# EAGLE design main (EAGLE 6.6.0)
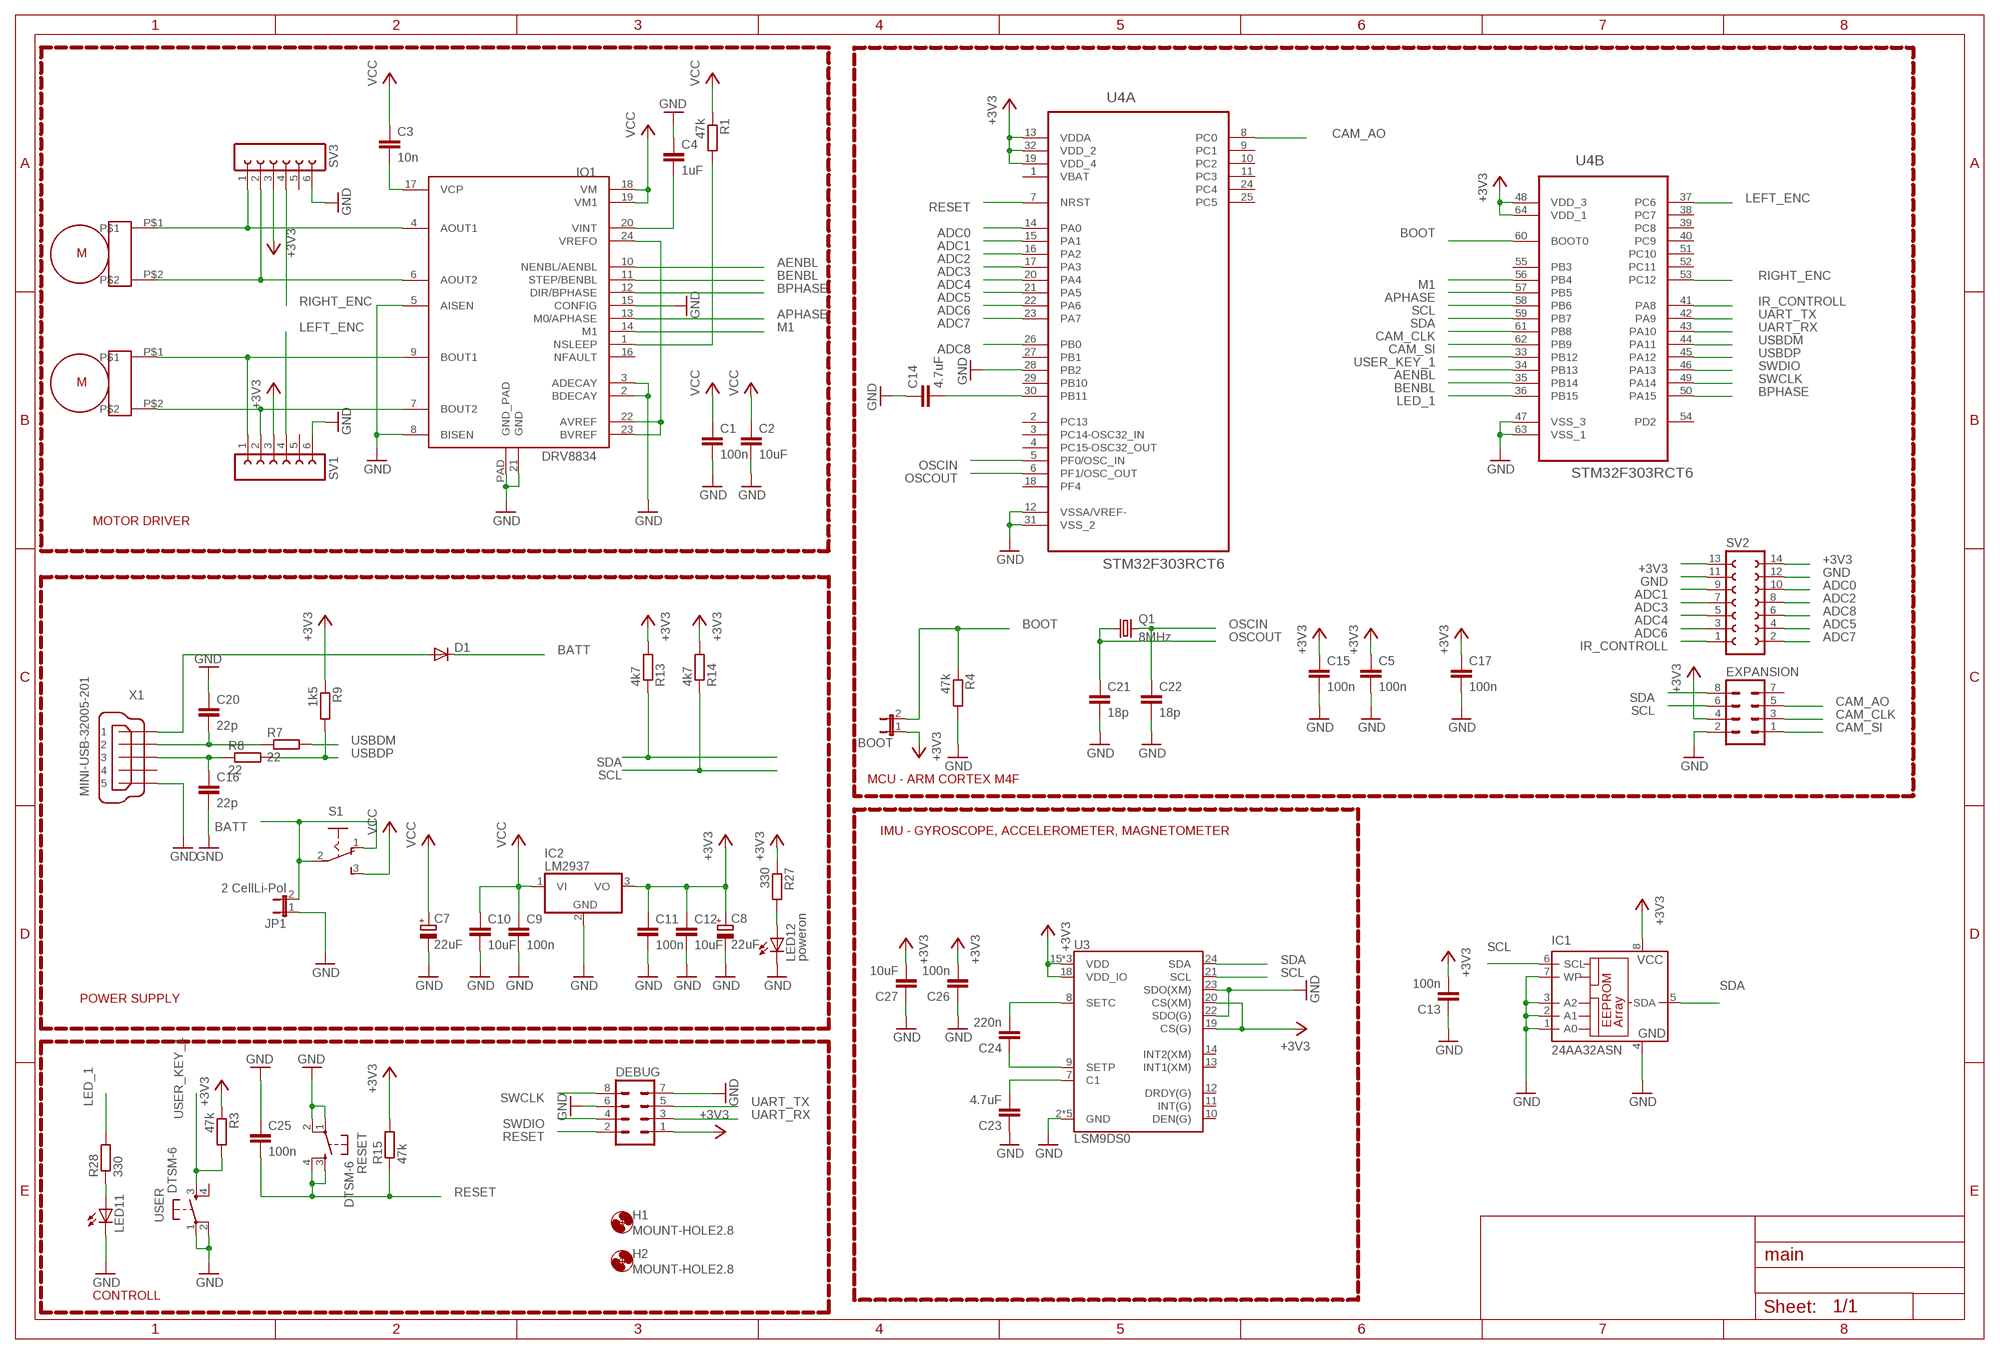
[diagram p0: schematic, sheet 1]

## Parts
BOOT  JP1E  [JP1]
C1  100n  C-EUC1206  [C1206]
C2  10uF  C-EUC1206  [C1206]
C3  10n  C-EUC1206  [C1206]
C4  1uF  C-EUC1206  [C1206]
C5  100n  C-EUC0805  [C0805]
C7  22uF  CPOL-EU153CLV-0505  [153CLV-0505]
C8  22uF  CPOL-EU153CLV-0505  [153CLV-0505]
C9  100n  C-EUC0805  [C0805]
C10  10uF  C-EUC0805  [C0805]
C11  100n  C-EUC0805  [C0805]
C12  10uF  C-EUC0805  [C0805]
C13  100n  C-EUC0805  [C0805]
C14  4.7uF  C-EUC0805  [C0805]
C15  100n  C-EUC0805  [C0805]
C16  22p  C-EUC0805  [C0805]
C17  100n  C-EUC0805  [C0805]
C20  22p  C-EUC0805  [C0805]
C21  18p  C-EUC0805  [C0805]
C22  18p  C-EUC0805  [C0805]
C23  4.7uF  C-EUC0805  [C0805]
C24  220n  C-EUC0805  [C0805]
C25  100n  C-EUC0805  [C0805]
C26  100n  C-EUC0805  [C0805]
C27  10uF  C-EUC0805  [C0805]
D1  DIODE-SMB  [SMB]
DEBUG  MA04-2  [MA04-2]
EXPANSION  MA04-2  [MA04-2]
H1  MOUNT-HOLE2.8  [2,8]
H2  MOUNT-HOLE2.8  [2,8]
IC1  24AA32ASN  [SO-08]
IC2  LM2937  [TO263-3]
IO1  DRV8834  [DRV8834_PCK]
JP1  2 CellLi-Pol  JP1E  [JP1]
LED11  LEDCHIPLED_1206  [CHIPLED_1206]
LED12  poweron  LEDCHIPLED_1206  [CHIPLED_1206]
Q1  8MHz  CRYSTALCTS406  [CTS406]
R1  47k  R-EU_M1206  [M1206]
R3  47k  R-EU_M0805  [M0805]
R4  47k  R-EU_M0805  [M0805]
R7  22  R-EU_M0805  [M0805]
R8  22  R-EU_M0805  [M0805]
R9  1k5  R-EU_M0805  [M0805]
R13  4k7  R-EU_M0805  [M0805]
R14  4k7  R-EU_M0805  [M0805]
R15  47k  R-EU_M0805  [M0805]
R27  330  R-EU_M0805  [M0805]
R28  330  R-EU_M0805  [M0805]
RESET  DTSM-6  [DTSM-6]
S1  255SB  [255SB]
SV1  FE06-1  [FE06]
SV2  FE07-2  [FE07-2]
SV3  FE06-1  [FE06]
U3  LSM9DS0  [LGA-24]
U4  STM32F303RCT6  [QFP50P1200X1200X160-64N]
U$1  MICRO_METAL_GEAR_MOTOR  [MICRO_METAL_GEAR_MOTOR]
U$2  MICRO_METAL_GEAR_MOTOR  [MICRO_METAL_GEAR_MOTOR]
USER  DTSM-6  [DTSM-6]
X1  MINI-USB-32005-201  [32005-201]

## Nets
+3V3: BOOT.1 C5.1 C8.+ C11.1 C12.1 C13.2 C15.1 C17.1 C26.2 C27.2 DEBUG.1 EXPANSION.4 IC1.8(VCC) IC2.3(VO) R3.1 R9.1 R13.2 R14.2 R15.2 R27.1 SV1.3 SV2.13 SV2.14 SV3.3 U3.15(VDD) U3.16(VDD) U3.17(VDD) U3.18(VDD_IO) U3.19(CS(G)) U3.20(CS(XM)) U4.13(A:VDDA) U4.19(A:VDD_4) U4.32(A:VDD_2) U4.48(B:VDD_3) U4.64(B:VDD_1)
ADC0: SV2.10 U4.14(A:PA0)
ADC1: SV2.9 U4.15(A:PA1)
ADC2: SV2.8 U4.16(A:PA2)
ADC3: SV2.7 U4.17(A:PA3)
ADC4: SV2.5 U4.20(A:PA4)
ADC5: SV2.4 U4.21(A:PA5)
ADC6: SV2.3 U4.22(A:PA6)
ADC7: SV2.2 U4.23(A:PA7)
ADC8: SV2.6 U4.26(A:PB0)
AENBL: IO1.10(NENBL/AENBL) U4.34(B:PB13)
APHASE: IO1.13(M0/APHASE) U4.57(B:PB5)
BATT: D1.C JP1.2 S1.1(O) S1.2(P)
BENBL: IO1.11(STEP/BENBL) U4.35(B:PB14)
BOOT: BOOT.2 R4.1 U4.60(B:BOOT0)
BPHASE: IO1.12(DIR/BPHASE) U4.50(B:PA15)
CAM_AO: EXPANSION.5 U4.8(A:PC0)
CAM_CLK: EXPANSION.3 U4.61(B:PB8)
CAM_SI: EXPANSION.1 U4.62(B:PB9)
GND: C1.2 C2.2 C4.1 C5.2 C7.- C8.- C9.2 C10.2 C11.2 C12.2 C13.1 C14.1 C15.2 C16.2 C17.2 C20.1 C21.2 C22.2 C23.1 C25.1 C26.1 C27.1 DEBUG.6 DEBUG.7 EXPANSION.2 IC1.1(A0) IC1.2(A1) IC1.3(A2) IC1.4(GND) IC1.7(WP) IC2.2(GND) IO1.2(BDECAY) IO1.3(ADECAY) IO1.5(AISEN) IO1.8(BISEN) IO1.15(CONFIG) IO1.21(GND) IO1.PAD(GND_PAD) JP1.1 LED11.C LED12.C R4.2 RESET.1 RESET.2 SV1.6 SV2.11 SV2.12 SV3.6 U3.2(GND) U3.3(GND) U3.4(GND) U3.5(GND) U3.6(GND) U3.22(SDO(G)) U3.23(SDO(XM)) U4.12(A:VSSA/VREF-) U4.28(A:PB2) U4.31(A:VSS_2) U4.47(B:VSS_3) U4.63(B:VSS_1) USER.1 USER.2 X1.5
IR_CONTROLL: SV2.1 U4.41(B:PA8)
LED_1: R28.2 U4.36(B:PB15)
LEFT_ENC: SV1.4 U4.37(B:PC6)
M1: IO1.14(M1) U4.56(B:PB4)
N$1: IO1.4(AOUT1) SV3.1 U$1.P$1
N$2: IO1.6(AOUT2) SV3.2 U$1.P$2
N$3: IO1.9(BOUT1) SV1.1 U$2.P$1
N$4: IO1.7(BOUT2) SV1.2 U$2.P$2
N$5: C3.2 IO1.17(VCP)
N$6: C23.2 U3.7(C1)
N$7: C24.2 U3.8(SETC)
N$8: IO1.22(AVREF) IO1.23(BVREF) IO1.24(VREFO)
N$9: IO1.1(NSLEEP) R1.2
N$13: C24.1 U3.9(SETP)
N$15: C14.2 U4.30(A:PB11)
N$22: C4.2 IO1.20(VINT)
N$23: LED12.A R27.2
N$33: LED11.A R28.1
N$55: C20.2 R7.1 X1.2
N$56: C16.1 R8.1 X1.3
N$57: D1.A X1.1
OSCIN: C22.1 Q1.3 U4.5(A:PF0/OSC_IN)
OSCOUT: C21.1 Q1.1 U4.6(A:PF1/OSC_OUT)
RESET: C25.2 DEBUG.2 R15.1 RESET.3 RESET.4 U4.7(A:NRST)
RIGHT_ENC: SV3.4 U4.53(B:PC12)
SCL: EXPANSION.6 IC1.6(SCL) R14.1 U3.21(SCL) U4.58(B:PB6)
SDA: EXPANSION.8 IC1.5(SDA) R13.1 U3.24(SDA) U4.59(B:PB7)
SWCLK: DEBUG.8 U4.49(B:PA14)
SWDIO: DEBUG.4 U4.46(B:PA13)
UART_RX: DEBUG.3 U4.43(B:PA10)
UART_TX: DEBUG.5 U4.42(B:PA9)
USBDM: R7.2 U4.44(B:PA11)
USBDP: R8.2 R9.2 U4.45(B:PA12)
USER_KEY_1: R3.2 U4.33(B:PB12) USER.3
VCC: C1.1 C2.1 C3.1 C7.+ C9.1 C10.1 IC2.1(VI) IO1.18(VM) IO1.19(VM1) R1.1 S1.3(S)
Unconnected: EXPANSION.7 IO1.16(NFAULT) SV1.5 SV3.5 U3.10(DEN(G)) U3.11(INT(G)) U3.12(DRDY(G)) U3.13(INT1(XM)) U3.14(INT2(XM)) U4.2(A:PC13) U4.3(A:PC14-OSC32_IN) U4.4(A:PC15-OSC32_OUT) U4.9(A:PC1) U4.10(A:PC2) U4.11(A:PC3) U4.18(A:PF4) U4.24(A:PC4) U4.25(A:PC5) U4.27(A:PB1) U4.29(A:PB10) U4.38(B:PC7) U4.39(B:PC8) U4.40(B:PC9) U4.51(B:PC10) U4.52(B:PC11) U4.54(B:PD2) U4.55(B:PB3) USER.4 X1.4

## Notes on the sheet
- MOTOR DRIVER
- MCU - ARM CORTEX M4F
- IMU - GYROSCOPE, ACCELEROMETER, MAGNETOMETER
- POWER SUPPLY
- CONTROLL

## Power pins joined to a net without a drawn wire
VBAT: U4.1(A:VBAT)

## Library data of the parts
BOOT JP1 = jumper:JP1E: JUMPER
C1-C5 C9-C17 C20-C27 = resistor:C-EU: CAPACITOR, European symbol
C7 C8 = resistor:CPOL-EU: POLARIZED CAPACITOR, European symbol
D1 = diode:DIODE-: DIODE
DEBUG EXPANSION = con-lstb:MA04-2: PIN HEADER; OC_FARNELL: unknown; OC_NEWARK: unknown
H1 H2 = holes:MOUNT-HOLE: MOUNTING HOLE with drill center marker
IC1 = microchip:24*: Serial EEPROM I2C; MF: MICROCHIP; MPN: 24AA32A-I/SN; OC_FARNELL: 1617659; OC_NEWARK: 83C5815
IC2 = linear:LM2937: LM2937-2.5, LM2937-3.3 400mA and 500mA Voltage Regulators Source: http://cache.national.com/ds/LM/LM2937-2.5.pdf
IO1 = yellow_car:DRV8834
LED11 LED12 = led:LED: LED OSRAM: - CHIPLED LG R971, LG N971, LY N971, LG Q971, LY Q971, LO R971, LY R971 LH N974, LH R974 LS Q976, LO Q976, LY Q976 LO Q996 - Hyper CHIPLED LW Q18S LB Q993, LB Q99A, LB R99A - SideLED LS A670, LO A670, LY A670, LG A670, LP A670 LB A673, LV A673, LT A673, LW A673 LH A674 LY A675 LS A676, LA A676, LO A676, LY A676, LW A676 LS A679, LY A679, LG A679 - Hyper Micro SIDELED® LS Y876, LA Y876, LO Y876, LY Y876 LT Y87S - SmartLED LW L88C, LW L88S LB L89C, LB L89S, LG L890 LS L89K, LO L89K, LY L89K LS L896, LA L896, LO L896, LY L896 - TOPLED LS T670, LO T670, LY T670, LG T670, LP T670 LSG T670, LSP T670, LSY T670, LOP T670, LYG T670 LG T671, LOG T671, LSG T671 LB T673, LV T673, LT T673, LW T673 LH T674 LS T676, LA T676, LO T676, LY T676, LB T676, LH T676, LSB T676, LW T676 LB T67C, LV T67C, LT T67C, LS T67K, LO T67K, LY T67K, LW E67C LS E67B, LA E67B, LO E67B, LY E67B, LB E67C, LV E67C, LT E67C LW T67C LS T679, LY T679, LG T679 LS T770, LO T770, LY T770, LG T770, LP T770 LB T773, LV T773, LT T773, LW T773 LH T774 LS E675, LA E675, LY E675, LS T675 LS T776, LA T776, LO T776, LY T776, LB T776 LHGB T686 LT T68C, LB T68C - Hyper Mini TOPLED® LB M676 - Mini TOPLED Santana® LG M470 LS M47K, LO M47K, LY M47K Source: http://www.osram.convergy.de LUXEON: - LUMILED® LXK2-PW12-R00, LXK2-PW12-S00, LXK2-PW14-U00, LXK2-PW14-V00 LXK2-PM12-R00, LXK2-PM12-S00, LXK2-PM14-U00 LXK2-PE12-Q00, LXK2-PE12-R00, LXK2-PE12-S00, LXK2-PE14-T00, LXK2-PE14-U00 LXK2-PB12-K00, LXK2-PB12-L00, LXK2-PB12-M00, LXK2-PB14-N00, LXK2-PB14-P00, LXK2-PB14-Q00 LXK2-PR12-L00, LXK2-PR12-M00, LXK2-PR14-Q00, LXK2-PR14-R00 LXK2-PD12-Q00, LXK2-PD12-R00, LXK2-PD12-S00 LXK2-PH12-R00, LXK2-PH12-S00 LXK2-PL12-P00, LXK2-PL12-Q00, LXK2-PL12-R00 Source: www.luxeon.com KINGBRIGHT: KA-3528ASYC Source: www.kingbright.com
Q1 = crystal:CRYSTAL: CRYSTAL; OC_FARNELL: unknown; OC_NEWARK: unknown
R1 R3 R4 R7-R9 R13-R15 R27 R28 = resistor:R-EU_: RESISTOR, European symbol
RESET USER = switch-tact:DTSM-6
S1 = switch:255SB: SLIDING SWITCH Distributor Buerklin, 11G810
SV1 SV3 = con-lsta:FE06-1: FEMALE HEADER; OC_FARNELL: unknown; OC_NEWARK: unknown
SV2 = con-lsta:FE07-2: FEMALE HEADER; OC_FARNELL: unknown; OC_NEWARK: unknown
U3 = SparkFun-DigitalIC:LSM9DS0: LSM9DS0 3D Accelerometer, 3D Gyroscope, 3D Magnetomter Features: 3 acceleration channels, 3 angular rate channels, 3 magnetic field channels ±2/±4/±6/±8/±16 g linear acceleration full scale ±2/±4/±8/±12 gauss magnetic full scale ±245/±500/±2000 dps angular rate full scale 16-bit data output SPI / I2C serial interfaces Analog supply voltage 2.4 V to 3.6 V Power-down mode / low-power mode Programmable interrupt generators Embedded self-test Embedded temperature sensor Embedded FIFO Position and motion detection functions Click/double-click recognition
U4 = my_parts:STM32F303RCT6: ARM Cortex-M4 32b MCU+FPU,LQFP-64; MPN: STM32F303RCT6; OC_FARNELL: 2215112; OC_NEWARK: 46W2193; PACKAGE: LQFP-64; SUPPLIER: STMICROELECTRONICS
U$1 U$2 = pololu:MICRO_METAL_GEAR_MOTOR
X1 = con-cypressindustries:MINI-USB-: MINI USB-B Conector Source: www.cypressindustries.com; OC_FARNELL: unknown; OC_NEWARK: unknown

## Board
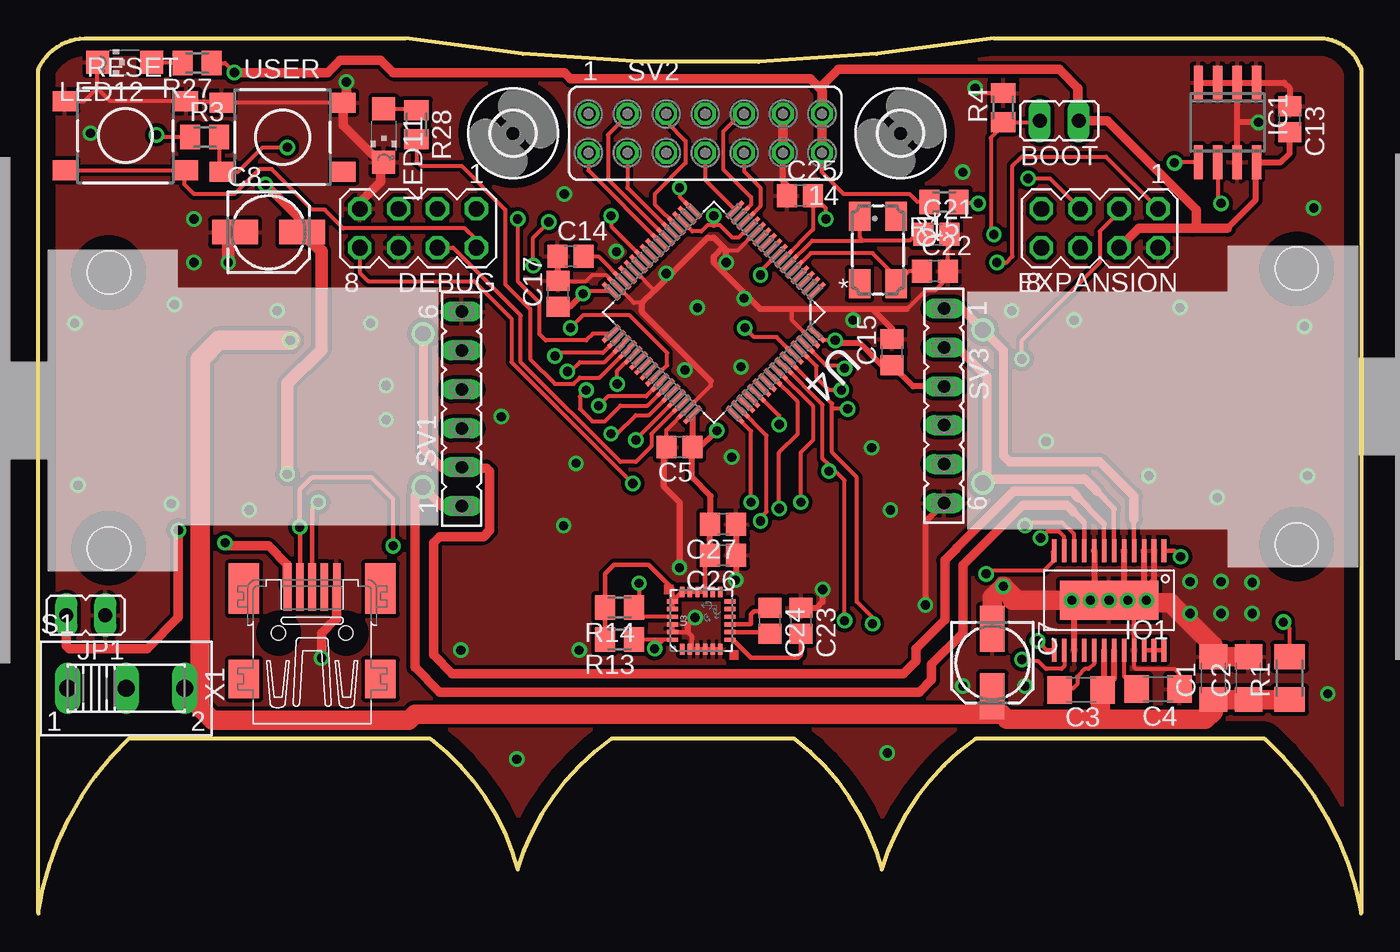
[diagram p1: board, top side]
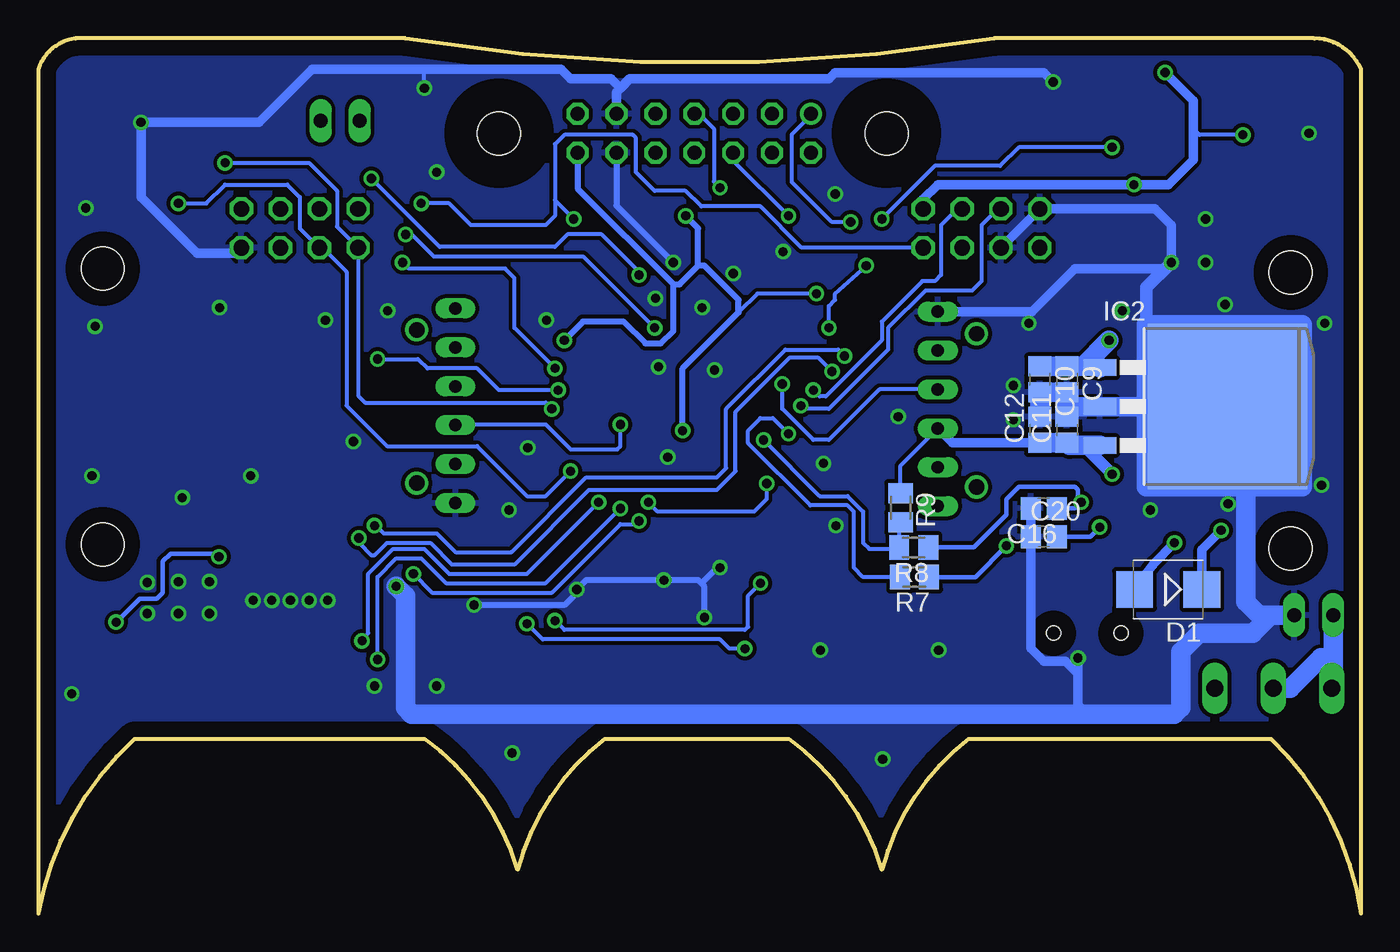
[diagram p2: board, bottom side, seen from below]

Size 86.36 x 57.1 mm. Coordinates in mm from the lower left corner, seen from the top.
Outline: 3.05,57.1 23.98,57.1 arc19 62.38,57.1 83.92,57.1 arc-66 86.36,55.07 86.36,0 arc38 80.06,11.38 61.16,11.38 arc38 55.07,2.85 arc38 49.38,11.38 37.39,11.38 arc38 31.29,2.85 arc38 25.6,11.38 5.89,11.38 arc38 0,0 0,55.07 arc-66 3.05,57.1
Copper layers (1*16): Top 0.035mm / dielectric 1.5mm / Bottom 0.035mm
Design rules "default *": minimum track width 10mil, minimum drill 24mil, track to track 10mil, track to pad 10mil, pad to pad 10mil, via to via 10mil, smd to smd 10mil, copper to edge 40mil, drill to drill 8mil, minimum pad ring 10mil, minimum via ring 8mil, stop-mask expansion 4mil, vias tented up to drill 0mil, thermal gap 10mil

### Footprints (pad centres in the part's own frame; a part is rotated, then mirrored left to right if it is on the bottom)
JP1 = drill 0.914 long: 1 0,-1.27; 2 0,1.27
C1206 = smd 1.6 x 1.8: 1 -1.4,0; 2 1.4,0
C0805 = smd 1.3 x 1.5: 1 -0.85,0; 2 0.85,0
153CLV-0505 = smd 3 x 1.6: + 2.2,0; - -2.2,0
SMB = smd 2.4 x 2.4: A 2.2,0; C -2.2,0
MA04-2 = drill 1.016 octagon: 1 -3.81,-1.27; 2 -3.81,1.27; 3 -1.27,-1.27; 4 -1.27,1.27; 5 1.27,-1.27; 6 1.27,1.27; 7 3.81,-1.27; 8 3.81,1.27
2,8 = hole 2.8: 0,0
SO-08 = smd 0.6 x 2.2: 1 -1.905,-2.6; 2 -0.635,-2.6; 3 0.635,-2.6; 4 1.905,-2.6; 5 1.905,2.6; 6 0.635,2.6; 7 -0.635,2.6; 8 -1.905,2.6
TO263-3 = smd 1.067 x 2.159: 1 -2.54,-5.791; 2 0,-5.791; 3 2.54,-5.791 | smd 10.8 x 10.41: TAB 0,2.54
DRV8834_PCK = smd 0.3 x 1.5: 1 -3.575,-3.25; 2 -2.925,-3.25; 3 -2.275,-3.25; 4 -1.625,-3.25; 5 -0.975,-3.25; 6 -0.325,-3.25; 7 0.325,-3.25; 8 0.975,-3.25; 9 1.625,-3.25; 10 2.275,-3.25; 11 2.925,-3.25; 12 3.575,-3.25; 13 3.575,3.25; 14 2.925,3.25; 15 2.275,3.25; 16 1.625,3.25; 17 0.975,3.25; 18 0.325,3.25; 19 -0.325,3.25; 20 -0.975,3.25; 21 -1.625,3.25; 22 -2.275,3.25; 23 -2.925,3.25; 24 -3.575,3.25 | smd 6.452 x 2.54: PAD 0,0
CHIPLED_1206 = smd 1.5 x 1.5: A 0,-1.75; C 0,1.75
CTS406 = smd 1.9 x 1.4: 1 -2.2,-1.2; 2 2.2,-1.2; 3 2.2,1.2; 4 -2.2,1.2
M1206 = smd 1.6 x 2: 1 -1.4,0; 2 1.4,0
M0805 = smd 1.3 x 1.6: 1 -0.95,0; 2 0.95,0
DTSM-6 = smd 1.55 x 1.3: 1 -3.975,2.25; 2 3.975,2.25; 3 -3.975,-2.25; 4 3.975,-2.25
255SB = drill 1.118 long: 1 -3.81,0; 2 0,0; 3 3.81,0
FE06 = drill 0.813 long: 1 -6.35,0; 2 -3.81,0; 3 -1.27,0; 4 1.27,0; 5 3.81,0; 6 6.35,0
FE07-2 = drill 0.914: 1 -7.62,1.27 | drill 0.914 octagon: 2 -7.62,-1.27; 3 -5.08,1.27; 4 -5.08,-1.27; 5 -2.54,1.27; 6 -2.54,-1.27; 7 0,1.27; 8 0,-1.27; 9 2.54,1.27; 10 2.54,-1.27; 11 5.08,1.27; 12 5.08,-1.27; 13 7.62,1.27; 14 7.62,-1.27
LGA-24 = smd 0.7 x 0.29: 1 -1.875,1.25; 2 -1.875,0.75; 3 -1.875,0.25; 4 -1.875,-0.25; 5 -1.875,-0.75; 6 -1.875,-1.25; 13 1.875,-1.25; 14 1.875,-0.75; 15 1.875,-0.25; 16 1.875,0.25; 17 1.875,0.75; 18 1.875,1.25 | smd 0.29 x 0.7: 7 -1.25,-1.875; 8 -0.75,-1.875; 9 -0.25,-1.875; 10 0.25,-1.875; 11 0.75,-1.875; 12 1.25,-1.875; 19 1.25,1.875; 20 0.75,1.875; 21 0.25,1.875; 22 -0.25,1.875; 23 -0.75,1.875; 24 -1.25,1.875
QFP50P1200X1200X160-64N = smd 1.473 x 0.279: 1 -5.715,3.759; 2 -5.715,3.251; 3 -5.715,2.743; 4 -5.715,2.261; 5 -5.715,1.753; 6 -5.715,1.245; 7 -5.715,0.762; 8 -5.715,0.254; 9 -5.715,-0.254; 10 -5.715,-0.762; 11 -5.715,-1.245; 12 -5.715,-1.753; 13 -5.715,-2.261; 14 -5.715,-2.743; 15 -5.715,-3.251; 16 -5.715,-3.759; 33 5.715,-3.759; 34 5.715,-3.251; 35 5.715,-2.743; 36 5.715,-2.261; 37 5.715,-1.753; 38 5.715,-1.245; 39 5.715,-0.762; 40 5.715,-0.254; 41 5.715,0.254; 42 5.715,0.762; 43 5.715,1.245; 44 5.715,1.753; 45 5.715,2.261; 46 5.715,2.743; 47 5.715,3.251; 48 5.715,3.759 | smd 0.279 x 1.473: 17 -3.759,-5.715; 18 -3.251,-5.715; 19 -2.743,-5.715; 20 -2.261,-5.715; 21 -1.753,-5.715; 22 -1.245,-5.715; 23 -0.762,-5.715; 24 -0.254,-5.715; 25 0.254,-5.715; 26 0.762,-5.715; 27 1.245,-5.715; 28 1.753,-5.715; 29 2.261,-5.715; 30 2.743,-5.715; 31 3.251,-5.715; 32 3.759,-5.715; 49 3.759,5.715; 50 3.251,5.715; 51 2.743,5.715; 52 2.261,5.715; 53 1.753,5.715; 54 1.245,5.715; 55 0.762,5.715; 56 0.254,5.715; 57 -0.254,5.715; 58 -0.762,5.715; 59 -1.245,5.715; 60 -1.753,5.715; 61 -2.261,5.715; 62 -2.743,5.715; 63 -3.251,5.715; 64 -3.759,5.715
MICRO_METAL_GEAR_MOTOR = drill 1: P$1 -5,1; P$2 5,1 | hole 2.8: -9,21.5; 9,21.5
32005-201 = smd 3.1 x 0.5: 1 3,1.6; 2 3,0.8; 3 3,0; 4 3,-0.8; 5 3,-1.6 | smd 2.5 x 2: M1 -3,-4.45; M2 -3,4.45 | smd 3.3 x 2: M3 2.9,4.45; M4 2.9,-4.45 | hole 0.9: 0,2.2; 0,-2.2

### Placement (x,y rotation side)
BOOT  66.65,51.71 90 top
C1  76.71,15.34 90 top
C2  78.99,15.34 90 top
C3  68.07,14.58 180 top
C4  73.1,14.63 180 top
C5  41.86,30.43 180 top
C7  62.28,16.36 270 top
C8  15.04,44.45 0 top
C9  19.2,34.85 270 bottom
C10  20.98,34.85 270 bottom
C11  19.2,31.55 90 bottom
C12  20.98,31.55 90 bottom
C13  81.69,51.82 270 top
C14  34.75,42.88 0 top
C15  55.73,36.63 90 top
C16  20.73,26.42 180 bottom
C17  33.93,40.44 90 top
C20  20.73,24.59 0 bottom
C21  58.62,44.3 0 top
C22  58.52,41.91 0 top
C23  49.78,19.1 270 top
C24  47.75,19.1 270 top
C25  49.73,46.84 0 top
C26  44.7,23.37 180 top
C27  44.7,25.4 180 top
D1  12.6,21.13 180 bottom
DEBUG  24.79,44.7 180 top
EXPANSION  69.29,44.7 180 top
H1  30.99,50.9 0 top
H2  56.29,50.9 0 top
IC1  77.62,51.61 180 top
IC2  11.28,33.07 270 bottom
IO1  69.9,20.42 180 top
JP1  3.1,19.46 90 top
LED11  22.56,50.75 180 top
LED12  5.64,55.52 90 top
Q1  54.81,43.28 270 top
R1  81.69,15.34 90 top
R3  10.87,50.65 0 top
R4  62.99,52.58 90 top
R7  29.16,21.95 180 bottom
R8  29.21,23.88 180 bottom
R9  30.07,26.47 270 bottom
R13  37.95,17.88 180 top
R14  37.95,19.96 180 top
R15  59.13,46.43 180 top
R27  10.36,55.47 180 top
R28  24.69,51.46 270 top
RESET  5.69,50.75 0 top
S1  5.74,14.68 0 top
SV1  27.64,32.92 90 top
SV2  43.54,50.9 0 top
SV3  59.13,33.12 270 top
U3  43.28,19.1 90 top
U4  44.09,39.22 225 top
U$1  60.66,33.07 270 top
U$2  26.11,32.82 90 top
USER  15.95,50.65 0 top
X1  17.88,18.29 90 top

### Tracks (layer width: path | path; a pad name or v marks a point on that pad's centre or on a via)
+3V3  (via drill 0.6)
  Top 0.254: R27.1 12.19,55.47 v12.8,54.86 | R3.1 7.87,50.65 v7.72,50.8 | C5.1 U4.48 | U4.13 46.48,44.86 45.72,44.09 45.31,44.09 44.5,44.91 44.09,44.91 43.69,44.91 43.28,44.5 42.69,44.5 U4.19 | R15.2 57.4,46.43 56.9,46.94 52.58,46.94 51.16,48.36 SV2.14 | U4.32 35.72,40.6 v35.56,40.44 | v52.02,37.39 51.24,37.39 U4.64
  Top 0.305: U3.20 U3.19 | U3.19 U3.18 U3.17 U3.16 U3.15 43.53,23.25 C26.2 | U3.19 41.41,21.18 39.83,22.76 37.59,22.76 36.98,22.15 36.98,19.98 R14.2 R13.2
  Top 0.406: C26.2 C27.2 43.89,25.44 43.89,27.23 42.67,28.45 42.67,30.28 | C13.2 81.69,49.58 81.12,49.01 IC1.8 79.45,48.94 79.45,46.53 77.62,44.7 | 42.67,30.28 42.67,30.39 C5.1 | U4.48 42.71,30.32 42.67,30.28 | 42.67,30.28 43.08,30.28 v44.3,31.5 | v44.09,45.52 44.09,44.91 | C17.1 34.71,39.59 v35.56,40.44 | SV3.3 57.11,34.39 C15.1 55.05,35.78 53.64,37.19 52.22,37.19 v52.02,37.39
  Top 0.61: C8.+ 17.07,44.62 17.07,45.31 v14.83,47.55 | v12.8,54.86 18.9,54.86 19.71,55.68 22.35,55.68 23.16,54.86 34.34,54.86 34.75,54.46 50.39,54.46 51.21,53.65 51.21,52.22 SV2.13 SV2.14 51.16,54 52.22,55.07 66.65,55.07 67.87,53.85 67.87,51.77 BOOT.1 69.8,51.71 75.59,45.92 75.59,44.91 75.39,44.7 | 75.39,44.7 71.83,44.7 EXPANSION.4 | 77.62,44.7 75.39,44.7
  Top 0.813: v16.26,28.65 16.26,34.54 18.49,36.78 18.49,43.2 C8.+
  Bottom 0.254: v7.72,50.8 10.57,50.8 10.97,51.21 | v35.56,40.44 39.42,40.44 40.64,39.22 | R9.1 30.07,29.21 SV1.3
  Bottom 0.406: SV2.14 51.16,47.3 44.91,41.05 | 44.91,41.05 44.5,41.05 43.28,42.27 | v44.3,31.5 44.3,35.56 40.64,39.22 40.64,40.03 42.88,42.27 43.28,42.27 | 43.28,42.27 43.28,44.7 v44.09,45.52 | 44.91,41.05 44.91,38 45.72,37.19 46.74,37.19 48.16,38.61 50.8,38.61 v52.02,37.39
  Bottom 0.61: DEBUG.1 28.6,46.58 27.63,47.55 v14.83,47.55 12.6,47.55 10.97,49.17 10.97,51.21 10.97,53.04 v12.8,54.86 | C12.1 26.68,30.7 SV1.3
  Bottom 0.813: C12.1 18.3,30.7 v16.26,28.65
  Bottom 1.27: IC2.3 19.04,30.53 C11.1 C12.1
ADC0
  Top 0.254: SV2.10 46.08,48.41 47.14,47.35 47.14,46.15 U4.14
ADC1
  Top 0.254: SV2.9 45.87,52.17 44.7,51 44.7,48.57 46.53,46.74 46.53,46.25 U4.15
ADC2
  Top 0.254: SV2.8 43.54,47.86 U4.16
ADC3  (via drill 0.6)
  Top 0.254: v41.86,47.35 41.86,46.77 U4.17
  Bottom 0.254: SV2.7 43.23,52.17 42.27,51.21 42.27,47.75 v41.86,47.35
ADC4
  Top 0.254: SV2.5 41,51.66 42.27,50.39 42.27,48.97 40.23,46.94 40.23,46.28 U4.20
ADC5
  Top 0.254: SV2.4 38.46,47.34 U4.21
ADC6
  Top 0.254: SV2.3 38.46,52.07 37.19,50.8 37.19,47.89 U4.22
ADC7
  Top 0.254: SV2.2 35.92,48.47 U4.23
ADC8  (via drill 0.6)
  Top 0.254: v37.39,45.52 37.39,44.85 U4.26
  Bottom 0.254: SV2.6 41,49.12 v37.39,45.52
AENBL  (via drill 0.6)
  Top 0.254: IO1.10 67.63,24.73 66.85,25.5 64.62,25.5 v64.41,25.3 | U4.34 36.85,36.58 33.93,36.58 v33.73,36.37
  Bottom 0.254: v64.41,25.3 64.31,25.3 63.8,24.79 60.35,24.79 59.13,23.57 55.47,23.57 50.6,28.45 42.06,28.45 41.45,29.06 41.45,32.92 37.59,36.78 34.14,36.78 v33.73,36.37
APHASE  (via drill 0.6)
  Top 0.254: IO1.13 65.84,17.17 v65.23,17.78 | v49.78,26.82 49.78,30.07 50.6,30.89 50.6,33.07 U4.57
  Bottom 0.254: v65.23,17.78 65.23,17.88 64.82,18.29 64.82,22.15 63.2,23.77 61.16,23.77 59.54,22.15 54.46,22.15 v49.78,26.82
BATT  (via drill 0.6)
  Top 0.61: v9.14,24.99 9.14,19.3 7.11,17.27 2.03,17.27 1.83,17.48 JP1.2
  Bottom 0.61: D1.C 10.4,23.74 v9.14,24.99
  Bottom 1.27: JP1.2 1.83,16.66 | 1.83,16.66 1.83,14.78 S1.1 | S1.2 4.62,14.68 2.64,16.66 1.83,16.66
BENBL  (via drill 0.6)
  Top 0.254: IO1.11 66.98,24.57 66.65,24.89 65.84,24.89 v65.43,24.49 | v34.54,35.36 34.75,35.36 35.36,35.97 36.96,35.97 U4.35
  Bottom 0.254: v65.43,24.49 65.43,24.18 64.62,23.37 64.41,23.37 63.6,24.18 60.76,24.18 59.33,22.76 55.27,22.76 50.39,27.64 42.06,27.64 40.84,28.85 40.84,32.72 37.28,36.28 35.47,36.28 v34.54,35.36 34.75,35.56
BOOT  (via drill 0.6)
  Top 0.254: BOOT.2 65.29,51.63 R4.1 62.99,51.41 62.18,50.6 62.18,44.5 v62.38,44.3 | U4.60 48.2,37.59 46.74,37.59 v46.13,38.2
  Bottom 0.254: v46.13,38.2 50.8,42.88 60.55,42.88 61.98,44.3 v62.38,44.3
BPHASE  (via drill 0.6)
  Top 0.254: 66.33,23.55 IO1.12 66.23,23.57 66.23,22.94 65.63,22.35 62.08,22.35 v61.87,22.15 | v47.14,25.6 47.14,25.81 47.55,26.21 47.55,31.17 U4.50
  Bottom 0.254: v61.87,22.15 60.65,20.93 52.83,20.93 48.36,25.4 47.35,25.4 v47.14,25.6
CAM_AO  (via drill 0.6)
  Top 0.254: v64.62,47.96 66.04,47.96 EXPANSION.5 | v47.14,41.66 47.14,41.91 U4.8
  Bottom 0.254: v47.14,41.66 47.14,41.86 49.58,44.3 51.82,44.3 52.63,43.49 60.15,43.49 v64.62,47.96
CAM_CLK  (via drill 0.6)
  Top 0.254: EXPANSION.3 70.56,45.77 69.29,44.5 69.29,42.47 64.21,37.39 v64.21,36.17 | v52.43,34.14 51.61,34.14 50.8,34.95 50.8,35.71 U4.61
  Bottom 0.254: v64.21,36.17 61.57,36.17 60.96,35.56 57.71,35.56 56.29,34.14 v52.43,34.14
CAM_SI  (via drill 0.6)
  Top 0.254: U4.62 50.07,37.1 51.41,35.76 52.43,35.76 v52.63,35.56 | v62.59,42.47 63.2,42.47 63.6,42.88 63.6,48.77 64.21,49.38 69.7,49.38 EXPANSION.1
  Bottom 0.254: v52.63,35.56 55.27,38.2 55.27,41.45 55.88,42.06 62.18,42.06 v62.59,42.47
GND  (via drill 0.6)
  Top 0.254: 72.18,20.46 72.3,20.46 v72.34,20.42 | v67.46,20.42 v68.68,20.42 IO1.PAD 70.31,20.02 | IO1.21 71.53,16.05 71.63,15.95 74.17,15.95 74.42,15.7 74.42,14.71 C4.1 | RESET.1 3.01,53 3.86,53.85 | 3.86,53.85 3.86,55.5 LED12.C | 3.86,53.85 4.71,53 RESET.2 11.87,53 USER.1 USER.2 | C5.2 41.01,31.53 U4.47 43.89,34.42 43.89,34.75 | C14.1 33.9,41.9 34.54,41.25 35.76,41.25 36.17,41.66 37.06,41.66 U4.31 38.89,39.83 39.42,39.83 | C21.2 59.37,44.2 C22.2 59.37,41.49 58.52,40.64 57.91,40.64 56.69,39.42 | R4.2 61.48,53.53 v61.16,53.85 | 44.91,43.28 45.68,43.28 U4.12 | 49.17,39.42 49.17,38.74 U4.63 | U4.28 38.85,42.02 40.23,40.64
  Top 0.305: 70.51,20.22 70.31,20.02 | 71.53,20.42 71.73,20.42 72.83,21.52 | 71.53,20.42 v71.12,20.42 71.04,20.42 70.88,20.58 | 67.97,20.32 68.07,20.42 v68.68,20.42 | 71.53,20.42 | 71.53,19.81 IO1.21 | U3.6 U3.5 U3.4 U3.3 U3.2 42.67,17.37 42.67,18.09 42.41,18.35 U3.23 U3.22
  Top 0.406: 71.73,20.42 71.53,20.22 71.53,19.81 72.18,20.46 IO1.3 | IO1.2 72.83,21.72 71.53,20.42 | IO1.5 70.88,20.58 70.51,20.22 | IO1.15 67.63,19.98 67.97,20.32 | IO1.8 68.93,20.58 69.09,20.42 | C27.1 C26.1 45.55,21.78 v45.52,21.74 | v51.21,21.13 51.21,20.32 50.8,19.91 49.82,19.91 C23.1 | 42.41,18.35 42.41,18.84 v42.88,19.3 | v41.86,22.56 41.86,26.82 40.84,27.84 40.84,30.26 C5.2 | IC1.4 IC1.3 IC1.2 | IC1.2 IC1.1 81.32,54.21 81.69,53.85 C13.1 | IC1.7 78.26,51.61 | 78.26,51.61 IC1.2 | v79.65,51.61 78.26,51.61 | 56.69,39.42 54.46,39.42 | 54.46,39.42 49.17,39.42 47.14,39.42 44.09,42.47 44.09,42.88 44.7,43.49 | 43.89,34.75 39.42,39.22 39.42,39.83 40.23,40.64 43.69,44.09 44.09,44.09 44.7,43.49 | 44.7,43.49 44.91,43.28 v44.91,42.47 | C25.1 48.88,47.48 48.62,47.75 SV2.12 | C17.2 33.93,42.84 C14.1 | C15.2 55.73,38.15 54.46,39.42 | SV3.6 57.91,25.55 v57.91,20.12
  Top 0.61: X1.5 19.48,19.18 19.38,19.18 18.49,18.29 v18.49,16.66 | DEBUG.7 20.98,46.38 22.35,47.75 22.35,48.8 LED11.C 22.32,49 19.91,51.41 19.91,52.89 USER.2 20.12,53.09 v20.12,54.25 | SV2.12 SV2.11
  Top 0.813: v12.4,42.47 12.4,44.01 C8.-
  Top 1.27: 63.6,20.42 v67.46,20.42 | 69.09,20.42 v68.68,20.42 63.91,20.42 v62.99,21.34 62.28,20.63 C7.- | v72.34,20.42 72.49,20.27 73.91,20.27 76.71,17.48 C1.2 C2.2
  Bottom 0.254: v61.16,53.85 61.16,55.07
  Bottom 0.406: v42.88,19.3 42.88,21.34 43.08,21.54 | 43.08,21.54 43.28,21.74 v45.52,21.74 50.6,21.74 v51.21,21.13 51.21,20.93 52.02,20.12 v57.91,20.12 | v41.86,22.56 42.06,22.56 43.08,21.54 | SV2.12 48.62,46.18 v44.91,42.47
  Bottom 0.61: v18.49,16.66 18.49,15.65 | 18.49,15.65 18.49,13.61 17.88,13.01 | C16.2 C20.1 21.58,17.31 20.73,16.46 19.3,16.46 18.49,15.65 | 48.36,53.85 48.62,53.59 SV2.11 | 48.36,53.85 47.75,54.46 34.75,54.46 34.34,54.86 20.73,54.86 v20.12,54.25 | 23.52,43.38 DEBUG.6 DEBUG.7 13.46,45.97 12.4,44.91 v12.4,42.47 12.8,42.06 18.69,42.06 21.49,39.27 SV1.6 | 48.36,53.85 48.97,54.46 51.61,54.46 52.22,55.07 61.16,55.07 68.48,55.07 71.93,51.61 v79.65,51.61 79.65,46.74 76,43.08 73.46,43.08 EXPANSION.2
  Bottom 0.813: 14.02,38.41 14.02,40.84 v12.4,42.47
  Bottom 1.27: v62.99,21.34 62.38,20.73 62.38,13.41 61.98,13.01 17.88,13.01 12.19,13.01 11.79,13.41 11.79,17.07 10.57,18.29 7.06,18.29 5.89,19.46 | JP1.1 5.89,19.46 | 5.89,19.46 6.65,19.46 7.52,20.32 7.52,27.64 7.31,27.84 | 14.02,33.07 IC2.2 19.25,33.07 19.3,33.12 19.3,32.5 C11.2 C9.2 C10.2 C12.2 | 14.02,33.07 14.02,38.41 3.86,38.41 3.86,27.84 7.31,27.84 | 7.31,27.84 14.02,27.84 14.02,33.07
  other vias: 77.22,19.56 75.18,19.56 75.18,21.64 77.22,21.64 69.9,20.42 79.25,19.56 79.25,21.59 72.49,28.55 84.18,14.33 60.35,14.83 10.16,42.47 64.41,14.83 13.77,26.31 2.59,27.94 2.39,38.51 15.6,39.32 22.71,34.44 22.71,32.21 8.89,39.73 8.69,26.72 10.16,45.31 65.79,30.78 54.41,30.38 55.63,26.31 67.61,38.71 63.55,39.32 34.29,25.3 27.58,17.17 3.4,50.9 43.03,39.52 35.1,29.36 30.23,32.41 35.31,17.17 31.24,10.06 55.42,10.46 82.65,38.3 82.85,28.55 74.52,39.52 76.96,27.13 83.26,46.02 53.19,38.71 45.26,29.77 42.21,35.46 46.08,40.13 60.35,48.36 34.34,46.94 21.69,38.51 45.87,35.66 41,41.76 37.74,43.18
  pour Bottom: -4.67,61.57 94.08,61.57 94.08,-3.86 -4.67,-3.86
  pour Top: -3.86,72.54 89.2,72.54 89.2,-5.49 -3.86,-5.49
IR_CONTROLL  (via drill 0.6)
  Top 0.254: U4.41 40.28,35 41.05,35.76 41.05,36.58 38.61,39.01 35.56,39.01 v34.75,38.2 | v32.31,42.27 32.31,44.09 v33.32,45.11
  Bottom 0.254: SV2.1 35.92,52.07 37.19,50.8 37.19,47.75 34.54,45.11 v33.32,45.11 | v34.75,38.2 34.75,39.62 34.34,40.03 34.34,40.44 v32.31,42.27
LED_1
  Top 0.254: R28.2 24.69,49.07 24.99,48.77 27.63,48.77 30.48,45.92 30.48,41.05 32.11,39.42 32.11,36.17 33.73,34.54 34.95,34.54 35.36,34.95 36.63,34.95 U4.36
LEFT_ENC  (via drill 0.6)
  Top 0.254: v37.79,34.54 37.79,35.4 U4.37
  Bottom 0.254: SV1.4 31.45,34.19 34.75,30.89 35.76,30.89 37.79,32.92 v37.79,34.54
M1  (via drill 0.6)
  Top 0.254: IO1.14 66.98,16.13 66.8,15.95 65.79,15.95 65.28,16.46 64.31,16.46 v64.21,16.56 | v48.36,26.42 48.36,30.07 49.58,31.29 49.58,33.37 U4.56
  Bottom 0.254: v64.21,16.56 64.21,21.95 62.99,23.17 61.37,23.17 59.74,21.54 53.24,21.54 v48.36,26.42 48.56,26.21
N$1
  Top 0.305: IO1.4 71.53,25.7
  Top 0.406: 71.53,25.7 71.53,25.71
  Top 0.61: 71.53,25.71 71.53,27.23 69.29,29.46 63.4,29.46 62.99,29.87 62.99,36.73 U$1.P$1 60.25,39.47 SV3.1
N$2
  Top 0.305: IO1.6 70.23,26.4
  Top 0.406: 70.23,26.4 69.09,27.53
  Top 0.61: 69.09,27.53 68.28,28.35 68.25,28.33 61.91,28.33 | 61.91,28.33 U$1.P$2 | 61.91,28.33 61.91,35.02 60.15,36.78 59.28,36.78 SV3.2
N$3
  Top 0.305: IO1.9 68.28,25.5
  Top 0.406: 68.28,25.5 67.56,26.21 67.46,26.31
  Top 0.61: 67.56,26.21 67.16,26.62 64.26,26.62 60.35,22.71 60.35,18.29 58.32,16.26 58.32,15.24 57.51,14.43 26.21,14.43 24.59,16.05 24.59,27.29 U$2.P$1 26.36,26.57 SV1.1
N$4
  Top 0.254: 27.69,29.06 SV1.2
  Top 0.305: IO1.7 69.58,25.42
  Top 0.406: 69.58,25.42 67.67,27.33
  Top 0.61: 67.87,27.13 67.67,27.33 67.46,27.53 63.65,27.53 59.94,23.83 59.94,23.8 59.18,23.04 59.18,19.15 57.3,17.27 57.3,16.46 56.49,15.65 27.03,15.65 25.81,16.87 25.81,24.18 26.21,24.59 29.06,24.59 29.46,24.99 29.46,28.85 29.26,29.06 27.69,29.06 | U$2.P$2 25.15,37.78 25.15,30.28 26.31,29.11 SV1.2
N$5
  Top 0.254: IO1.17 68.93,16.3 68.58,15.95 68.33,15.95 67.82,15.44 67.82,14.94 67.56,14.68 66.77,14.68 C3.2
N$6
  Top 0.305: U3.7 45.34,17.85 46.53,16.66 49.58,16.66 49.78,16.87 C23.2
N$7
  Top 0.305: U3.8 47.65,18.35 C24.2
N$8
  Top 0.305: IO1.24 IO1.23 IO1.22
N$9  (via drill 0.6)
  Top 0.254: R1.2 81.69,18.59 v81.28,19
  Top 0.305: IO1.1 74.17,23.67 v74.57,23.27
  Bottom 0.305: v74.57,23.27 74.78,23.47 77.72,23.47 78.23,22.96 78.23,20.93 78.64,20.52 79.76,20.52 v81.28,19
N$13
  Top 0.305: U3.9 46.49,18.85 46.53,18.9 46.53,19.51 46.74,19.71 47.51,19.71 C24.1
N$15
  Top 0.254: C14.2 36.56,42.88 U4.30
N$22
  Top 0.254: IO1.20 70.88,15.46 C4.2
N$23
  Top 0.254: LED12.A 9.36,55.52 R27.2
N$33
  Top 0.254: LED11.A 24.6,52.5 R28.1
N$55  (via drill 0.6)
  Top 0.305: X1.2 17.08,25.18 v17.07,25.2 17.07,27.64 17.88,28.45 21.74,28.45 23.16,27.03 v23.16,23.98
  Bottom 0.305: C20.2 17.68,24.59 v17.07,25.2 | R7.1 25.2,21.95 v23.16,23.98
N$56  (via drill 0.6)
  Top 0.305: X1.3 17.88,26.42 v18.29,26.82
  Bottom 0.305: C16.1 18.69,26.42 v18.29,26.82 18.49,27.03 18.49,27.64 18.69,27.84 22.35,27.84 23.16,27.03 23.16,26.01 25.3,23.88 R8.1
N$57  (via drill 0.6)
  Top 0.406: 16.26,21.31 X1.1
  Top 0.61: 16.26,21.31 16.26,22.76 15.04,23.98 12.4,23.98 v12.19,24.18
  Bottom 0.61: D1.A 13.58,22.79 v12.19,24.18
OSCIN
  Top 0.254: U4.5 50.43,43.08 54.46,43.08 56.01,41.52 Q1.3 56.84,41.91 C22.1
OSCOUT
  Top 0.254: 53.41,45.48 Q1.1 53.64,45.45 53.64,44.09 53.85,43.89 | U4.6 50.53,43.89 53.85,43.89 | C21.1 57.3,44.3 56.9,43.89 54.86,43.89 53.85,43.89
RESET  (via drill 0.6)
  Top 0.254: RESET.3 RESET.4 9.55,48.39 9.55,47.55 10.16,46.94 12.8,46.94 14.43,48.57 15.24,48.57 17.88,45.92 18.69,45.92 19.91,44.7 27.84,44.7 28.6,43.94 DEBUG.2 | U4.7 50.58,44.63 C25.2 51.41,46.01 v51.41,45.31 | v61.37,46.33 60.18,46.33 R15.1
  Bottom 0.254: DEBUG.2 36.52,43.43 39.22,46.13 43.08,46.13 44.09,47.14 46.13,47.14 47.35,48.36 47.35,50.6 47.55,50.8 52.02,50.8 52.63,50.19 52.63,46.53 | 52.63,46.53 v51.41,45.31 | 52.63,46.53 52.63,45.52 53.24,44.91 58.12,44.91 59.54,46.33 v61.37,46.33
RIGHT_ENC  (via drill 0.6)
  Top 0.254: v48.36,31.9 48.36,32.47 U4.53
  Bottom 0.254: SV3.4 59.08,31.9 53.24,31.9 51.61,30.28 48.56,30.28 48.36,30.48 v48.36,31.9
SCL  (via drill 0.6)
  Top 0.254: IC1.6 76.99,46.56 v77.22,46.33 | v52.63,19.1 52.63,28.25 51.61,29.26 | U4.58 51.21,33.18 51.21,29.67 51.61,29.26 | v39.22,21.54 39.22,20.28 R14.1 39.51,19.35 U3.21 | v51.61,28.85 51.61,29.26
  Bottom 0.254: v77.22,46.33 75.39,46.33 74.17,47.55 70.1,47.55 69.29,46.74 69.29,44.7 EXPANSION.6 68.02,43.23 67.62,43.23 66.24,41.86 66.24,33.12 63.6,30.48 57.71,30.48 54.46,27.23 53.24,27.23 v51.61,28.85 | v52.63,19.1 52.02,18.49 40.23,18.49 40.03,18.69 40.03,20.73 v39.22,21.54
SDA  (via drill 0.6)
  Top 0.254: IC1.5 74.21,49.01 v74.17,48.97 | R13.1 38.93,17.85 U3.24 40.81,17.85 v40.23,17.27 | v54.46,18.9 54.46,19.3 53.44,20.32 53.44,28.45 51.82,30.07 51.82,32.92 | 51.82,32.92 51.82,33.26 U4.59 | v52.83,32.92 51.82,32.92
  Bottom 0.254: v74.17,48.97 68.68,48.97 66.85,47.14 66.85,44.81 EXPANSION.8 65.48,33.78 65.02,33.33 53.24,33.33 v52.83,32.92 | v40.23,17.27 41.25,17.27 41.86,17.88 53.44,17.88 v54.46,18.9
SWCLK  (via drill 0.6)
  Top 0.254: DEBUG.8 20.98,41.81 21.54,41.25 28.45,41.25 30.89,38.81 30.89,35.97 v38.81,28.04 | U4.49 46.53,31.46 v46.53,26.82
  Bottom 0.254: v38.81,28.04 38.81,27.03 39.62,26.21 45.92,26.21 v46.53,26.82
SWDIO
  Top 0.254: DEBUG.4 27.08,43.43 30.48,40.03 30.89,39.62 31.5,39.01 31.5,35.97 38,29.46 39.01,29.46 40.03,30.48 40.03,31.29 41.97,33.24 U4.46
UART_RX  (via drill 0.6)
  Top 0.254: v35.76,34.14 35.36,33.73 35.36,32.92 36.17,32.11 36.98,32.11 38,33.12 39.76,33.12 U4.43
  Bottom 0.254: DEBUG.3 26.36,45.97 27.43,44.91 27.43,41.66 27.84,41.25 28.65,41.25 31.29,38.61 31.29,37.39 34.95,33.73 35.36,33.73 v35.76,34.14
UART_TX  (via drill 0.6)
  Top 0.254: U4.42 39.69,33.73 37.19,33.73 v36.58,33.12
  Bottom 0.254: DEBUG.5 23.72,45.97 24.79,44.91 24.79,41.25 25.4,40.64 28.45,40.64 30.89,38.2 30.89,36.78 34.75,32.92 36.37,32.92 v36.58,33.12
USBDM  (via drill 0.6)
  Top 0.254: v37.39,31.29 37.79,31.29 39.01,32.51 39.87,32.51 U4.44
  Bottom 0.254: R7.2 32.51,21.95 33.12,22.56 33.12,26.21 33.53,26.62 35.97,26.62 40.03,30.68 40.03,31.5 39.22,32.31 38.41,32.31 v37.39,31.29
USBDP  (via drill 0.6)
  Top 0.254: v39.01,30.89 39.01,30.94 U4.45
  Bottom 0.254: v39.01,30.89 35.36,27.23 33.53,27.23 32.51,26.21 32.51,24.18 32.11,23.77 30.26,23.77 R8.2 30.16,25.43 R9.2
  Bottom 0.305: 30.16,25.78 R9.2
USER_KEY_1  (via drill 0.6)
  Top 0.254: R3.2 11.82,48.55 USER.3 13.04,48.4 14.63,49.99 v16.26,49.99 | v31.29,45.31 31.29,41.25 32.71,39.83 32.71,37.8 33.12,37.39 35.76,37.39 36.21,37.83 U4.33
  Bottom 0.254: v16.26,49.99 22.35,49.99 23.57,48.77 27.84,48.77 v31.29,45.31
VCC  (via drill 0.6)
  Top 0.254: C7.+ 62.28,13.11 62.38,13.01
  Top 0.305: 69.58,14.43 C3.1
  Top 0.406: 10.97,20.02 10.67,20.02 10.57,20.12 | IO1.18 69.58,14.68 C3.1 70.23,15.33 IO1.19
  Top 1.27: 69.49,14.3 C3.1 69.34,14.2 69.34,12.9 69.09,12.65 | 69.09,12.65 63.25,12.65 62.89,13.01 62.38,13.01 24.59,13.01 24.18,12.6 11.38,12.6 10.57,13.41 10.57,15.04 | 69.09,12.65 76.2,12.65 76.71,13.16 C1.1 C2.1 R1.1 | S1.3 10.21,14.68 10.57,15.04 | 10.57,15.04 10.57,20.12 10.57,36.17 11.79,37.39 v16.46,37.39
  Bottom 1.27: IC2.1 17.16,35.7 C9.1 C10.1 18.15,35.7 v16.46,37.39
(copper drawn outside any net)
  shapes: Top area x2